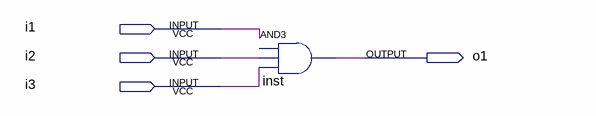
[diagram p0: schematic sheet]
// Quartus schematic and_3.bdf as structural Verilog: 1 symbols, 4 pins
module and_3 (
  input  i1,
  input  i2,
  input  i3,
  output o1
);

  and inst (o1, i2, i3);  // open: IN1
endmodule
